# Altium schematic sheet Arduino_Shields.SchDoc
size A4; SheetNumber: 2; SheetTotal: 11
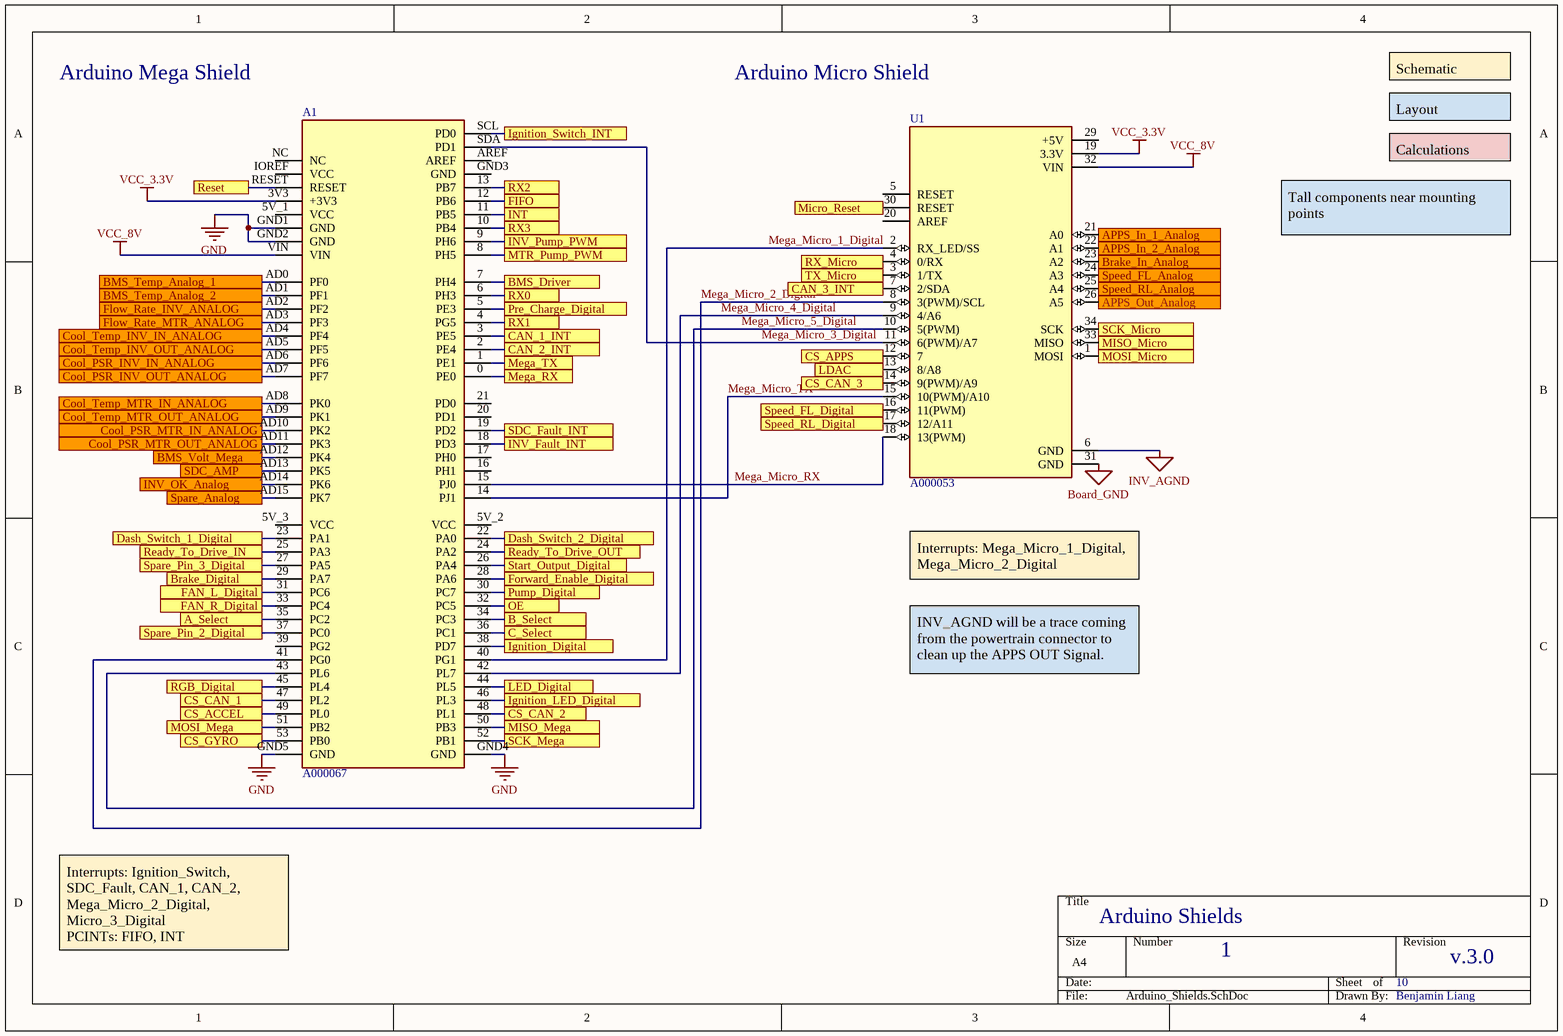
[diagram p0: Arduino_Shields.SchDoc]

## Parts
A1  A000067  [ARDUINO_A000067]
U1  A000053  [ARDUINO_A000053]

## Ports
A_Select, APPS_In_1_Analog, APPS_In_2_Analog, APPS_Out_Analog, B_Select, BMS_Driver, BMS_Temp_Analog_1, BMS_Temp_Analog_2, BMS_Volt_Mega, Brake_Digital, Brake_In_Analog, C_Select, CAN_1_INT, CAN_2_INT, CAN_3_INT, Cool_PSR_INV_IN_ANALOG, Cool_PSR_INV_OUT_ANALOG, Cool_PSR_MTR_IN_ANALOG, Cool_PSR_MTR_OUT_ANALOG, Cool_Temp_INV_IN_ANALOG, Cool_Temp_INV_OUT_ANALOG, Cool_Temp_MTR_IN_ANALOG, Cool_Temp_MTR_OUT_ANALOG, CS_ACCEL, CS_APPS, CS_CAN_1, CS_CAN_2, CS_CAN_3, CS_GYRO, Dash_Switch_1_Digital, Dash_Switch_2_Digital, FAN_L_Digital, FAN_R_Digital, FIFO, Flow_Rate_INV_ANALOG, Flow_Rate_MTR_ANALOG, Forward_Enable_Digital, Ignition_Digital, Ignition_LED_Digital, Ignition_Switch_INT, INT, INV_Fault_INT, INV_OK_Analog, INV_Pump_PWM, LDAC, LED_Digital, Mega_RX, Mega_TX, Micro_Reset, MISO_Mega, MISO_Micro, MOSI_Mega, MOSI_Micro, MTR_Pump_PWM, OE, Pre_Charge_Digital, Pump_Digital, Ready_To_Drive_IN, Ready_To_Drive_OUT, Reset, RGB_Digital, RX0, RX1, RX2, RX3, RX_Micro, SCK_Mega, SCK_Micro, SDC_AMP, SDC_Fault_INT, Spare_Analog, Spare_Pin_2_Digital, Spare_Pin_3_Digital, Speed_FL_Analog, Speed_FL_Digital, Speed_RL_Analog, Speed_RL_Digital, Start_Output_Digital, TX_Micro

## Nets
Board_GND: U1.31(GND)
GND: A1.GND1(GND) A1.GND2(GND) A1.GND4(GND) A1.GND5(GND)
INV_AGND: U1.6(GND)
VCC_3.3V: A1.3V3(+3V3) U1.19(3.3V)
VCC_8V: A1.VIN U1.32(VIN)
A_Select: A1.35(PC2) ; port A_Select
APPS_In_1_Analog: U1.21(A0) ; port APPS_In_1_Analog
APPS_In_2_Analog: U1.22(A1) ; port APPS_In_2_Analog
APPS_Out_Analog: U1.26(A5) ; port APPS_Out_Analog
B_Select: A1.34(PC3) ; port B_Select
BMS_Driver: A1.7(PH4) ; port BMS_Driver
BMS_Temp_Analog_1: A1.AD0(PF0) ; port BMS_Temp_Analog_1
BMS_Temp_Analog_2: A1.AD1(PF1) ; port BMS_Temp_Analog_2
BMS_Volt_Mega: A1.AD12(PK4) ; port BMS_Volt_Mega
Brake_Digital: A1.29(PA7) ; port Brake_Digital
Brake_In_Analog: U1.23(A2) ; port Brake_In_Analog
C_Select: A1.36(PC1) ; port C_Select
CAN_1_INT: A1.3(PE5) ; port CAN_1_INT
CAN_2_INT: A1.2(PE4) ; port CAN_2_INT
CAN_3_INT: U1.7(2/SDA) ; port CAN_3_INT
Cool_PSR_INV_IN_ANALOG: A1.AD6(PF6) ; port Cool_PSR_INV_IN_ANALOG
Cool_PSR_INV_OUT_ANALOG: A1.AD7(PF7) ; port Cool_PSR_INV_OUT_ANALOG
Cool_PSR_MTR_IN_ANALOG: A1.AD10(PK2) ; port Cool_PSR_MTR_IN_ANALOG
Cool_PSR_MTR_OUT_ANALOG: A1.AD11(PK3) ; port Cool_PSR_MTR_OUT_ANALOG
Cool_Temp_INV_IN_ANALOG: A1.AD4(PF4) ; port Cool_Temp_INV_IN_ANALOG
Cool_Temp_INV_OUT_ANALOG: A1.AD5(PF5) ; port Cool_Temp_INV_OUT_ANALOG
Cool_Temp_MTR_IN_ANALOG: A1.AD8(PK0) ; port Cool_Temp_MTR_IN_ANALOG
Cool_Temp_MTR_OUT_ANALOG: A1.AD9(PK1) ; port Cool_Temp_MTR_OUT_ANALOG
CS_ACCEL: A1.49(PL0) ; port CS_ACCEL
CS_APPS: U1.12(7) ; port CS_APPS
CS_CAN_1: A1.47(PL2) ; port CS_CAN_1
CS_CAN_2: A1.48(PL1) ; port CS_CAN_2
CS_CAN_3: U1.14(9(PWM)/A9) ; port CS_CAN_3
CS_GYRO: A1.53(PB0) ; port CS_GYRO
Dash_Switch_1_Digital: A1.23(PA1) ; port Dash_Switch_1_Digital
Dash_Switch_2_Digital: A1.22(PA0) ; port Dash_Switch_2_Digital
FAN_L_Digital: A1.31(PC6) ; port FAN_L_Digital
FAN_R_Digital: A1.33(PC4) ; port FAN_R_Digital
FIFO: A1.12(PB6) ; port FIFO
Flow_Rate_INV_ANALOG: A1.AD2(PF2) ; port Flow_Rate_INV_ANALOG
Flow_Rate_MTR_ANALOG: A1.AD3(PF3) ; port Flow_Rate_MTR_ANALOG
Forward_Enable_Digital: A1.28(PA6) ; port Forward_Enable_Digital
Ignition_Digital: A1.38(PD7) ; port Ignition_Digital
Ignition_LED_Digital: A1.46(PL3) ; port Ignition_LED_Digital
Ignition_Switch_INT: A1.SCL(PD0) ; port Ignition_Switch_INT
INT: A1.11(PB5) ; port INT
INV_Fault_INT: A1.18(PD3) ; port INV_Fault_INT
INV_OK_Analog: A1.AD14(PK6) ; port INV_OK_Analog
INV_Pump_PWM: A1.9(PH6) ; port INV_Pump_PWM
LDAC: U1.13(8/A8) ; port LDAC
LED_Digital: A1.44(PL5) ; port LED_Digital
Mega_Micro_1_Digital: A1.40(PG1) U1.2(RX_LED/SS)
Mega_Micro_2_Digital: A1.41(PG0) U1.8(3(PWM)/SCL)
Mega_Micro_3_Digital: A1.SDA(PD1) U1.11(6(PWM)/A7)
Mega_Micro_4_Digital: A1.42(PL7) U1.9(4/A6)
Mega_Micro_5_Digital: A1.43(PL6) U1.10(5(PWM))
Mega_Micro_RX: A1.15(PJ0) U1.18(13(PWM))
Mega_Micro_TX: A1.14(PJ1) U1.15(10(PWM)/A10)
Mega_RX: A1.0(PE0) ; port Mega_RX
Mega_TX: A1.1(PE1) ; port Mega_TX
Micro_Reset: U1.30(RESET) ; port Micro_Reset
MISO_Mega: A1.50(PB3) ; port MISO_Mega
MISO_Micro: U1.33(MISO) ; port MISO_Micro
MOSI_Mega: A1.51(PB2) ; port MOSI_Mega
MOSI_Micro: U1.1(MOSI) ; port MOSI_Micro
MTR_Pump_PWM: A1.8(PH5) ; port MTR_Pump_PWM
OE: A1.32(PC5) ; port OE
Pre_Charge_Digital: A1.5(PE3) ; port Pre_Charge_Digital
Pump_Digital: A1.30(PC7) ; port Pump_Digital
Ready_To_Drive_IN: A1.25(PA3) ; port Ready_To_Drive_IN
Ready_To_Drive_OUT: A1.24(PA2) ; port Ready_To_Drive_OUT
Reset: A1.RESET ; port Reset
RGB_Digital: A1.45(PL4) ; port RGB_Digital
RX0: A1.6(PH3) ; port RX0
RX1: A1.4(PG5) ; port RX1
RX2: A1.13(PB7) ; port RX2
RX3: A1.10(PB4) ; port RX3
RX_Micro: U1.4(0/RX) ; port RX_Micro
SCK_Mega: A1.52(PB1) ; port SCK_Mega
SCK_Micro: U1.34(SCK) ; port SCK_Micro
SDC_AMP: A1.AD13(PK5) ; port SDC_AMP
SDC_Fault_INT: A1.19(PD2) ; port SDC_Fault_INT
Spare_Analog: A1.AD15(PK7) ; port Spare_Analog
Spare_Pin_2_Digital: A1.37(PC0) ; port Spare_Pin_2_Digital
Spare_Pin_3_Digital: A1.27(PA5) ; port Spare_Pin_3_Digital
Speed_FL_Analog: U1.24(A3) ; port Speed_FL_Analog
Speed_FL_Digital: U1.16(11(PWM)) ; port Speed_FL_Digital
Speed_RL_Analog: U1.25(A4) ; port Speed_RL_Analog
Speed_RL_Digital: U1.17(12/A11) ; port Speed_RL_Digital
Start_Output_Digital: A1.26(PA4) ; port Start_Output_Digital
TX_Micro: U1.3(1/TX) ; port TX_Micro

Not connected (* = marked no-connect by the designer): A1 5V_1(VCC) 5V_2(VCC) 5V_3(VCC) 16(PH1) 17(PH0) 20(PD1) 21(PD0) 39(PG2) AREF GND3(GND) IOREF(VCC) NC; U1 5(RESET) 20(AREF) 29(+5V)

## Notes on the sheet
- Arduino Mega Shield
- Arduino Micro Shield
- Schematic
- Layout
- Calculations
- Tall components near mounting points
- Interrupts: Mega_Micro_1_Digital, Mega_Micro_2_Digital
- INV_AGND will be a trace coming from the powertrain connector to clean up the APPS OUT Signal.
- Arduino Shields
- Interrupts: Ignition_Switch, SDC_Fault, CAN_1, CAN_2, Mega_Micro_2_Digital, Micro_3_Digital                                PCINTs: FIFO, INT
- 1
- 10
- v.3.0
- Benjamin Liang

## Library data of the parts
A1 = A000067: ATmega2560 Arduino Mega2560 AVRÂ® ATmega AVR MCU 8-Bit Embedded Evaluation Board; Availability: Unavailable; Package: None; SnapEDA_Link: https://www.snapeda.com/parts/A000067/Arduino/view-part/557398/?ref=snap; MP: A000067; Price: None; Value: *; MF: Arduino
U1 = A000053: ATmega32U4 Arduino Micro AVRÂ® ATmega AVR MCU 8-Bit Embedded Evaluation Board; MP: A000053; SnapEDA_Link: https://www.snapeda.com/parts/A000053/Arduino/view-part/50900/?ref=snap; Digi-Key_Part_Number: 1050-1066-ND; MF: Arduino; Digi-Key_Purchase_URL: https://www.digikey.com/product-detail/en/arduino/A000053/1050-1066-ND/4486332?utm_source=snapeda&utm_medium=aggregator&utm_campaign=symbol; Package: None; Value: *